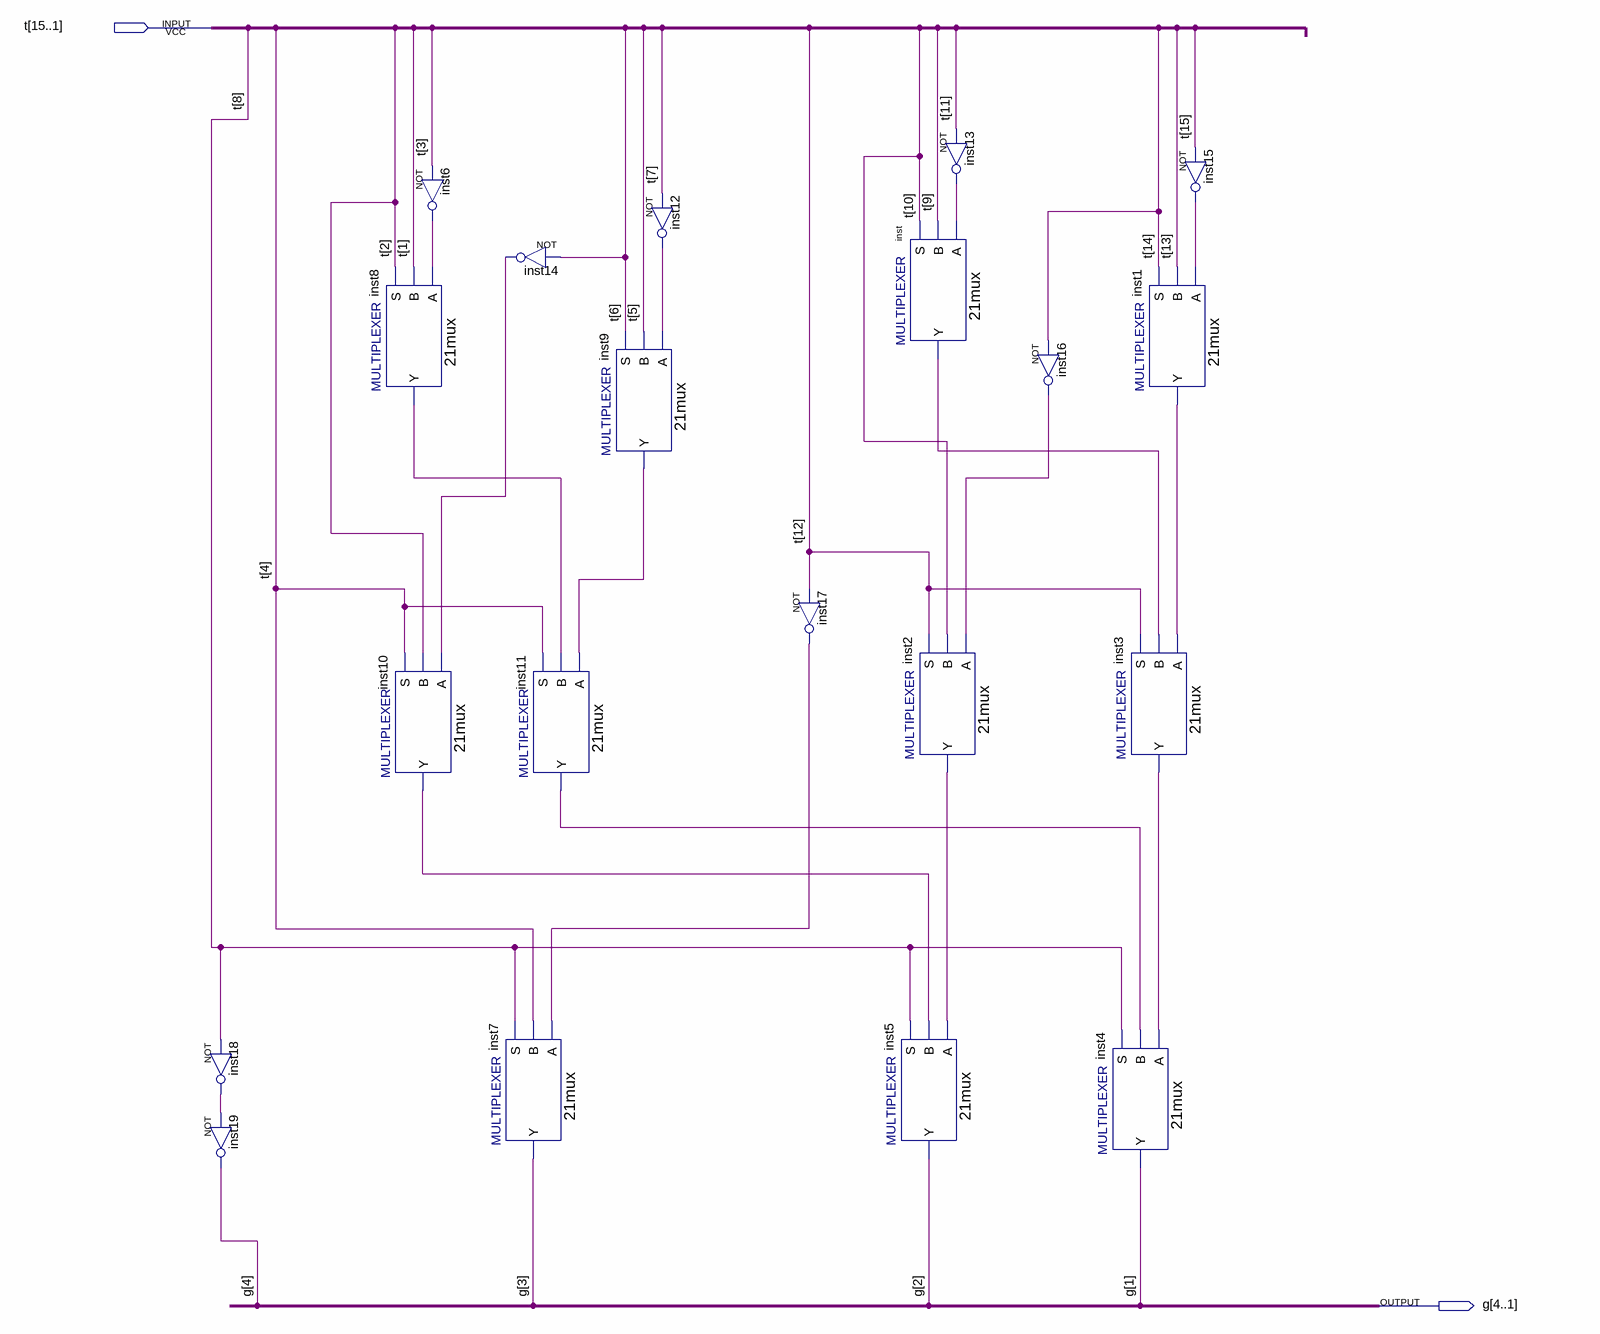
[diagram p0: schematic sheet]
// Quartus schematic decoder.bdf as structural Verilog: 20 symbols, 2 pins
module decoder (
  input  [15:1] t,
  output [4:1] g
);

  wire inst1_y, inst2_y, inst3_y, inst6_out, inst8_y, inst9_y, inst10_y, inst11_y, inst12_out, inst13_out,
       inst14_out, inst15_out, inst16_out, inst17_out, inst18_out, inst_y;

  not inst18 (inst18_out, t[8]);
  not inst19 (g[4], inst18_out);
  \21mux  inst8 (.S(t[2]), .B(t[1]), .A(inst6_out), .Y(inst8_y));
  \21mux  inst10 (.S(t[4]), .B(t[2]), .A(inst14_out), .Y(inst10_y));
  not inst6 (inst6_out, t[3]);
  not inst14 (inst14_out, t[6]);
  \21mux  inst11 (.S(t[4]), .B(inst8_y), .A(inst9_y), .Y(inst11_y));
  \21mux  inst7 (.S(t[8]), .B(t[4]), .A(inst17_out), .Y(g[3]));
  \21mux  inst9 (.S(t[6]), .B(t[5]), .A(inst12_out), .Y(inst9_y));
  not inst12 (inst12_out, t[7]);
  not inst17 (inst17_out, t[12]);
  \21mux  inst (.S(t[10]), .B(t[9]), .A(inst13_out), .Y(inst_y));
  \21mux  inst2 (.S(t[12]), .B(t[10]), .A(inst16_out), .Y(inst2_y));
  \21mux  inst5 (.S(t[8]), .B(inst10_y), .A(inst2_y), .Y(g[2]));
  not inst13 (inst13_out, t[11]);
  not inst16 (inst16_out, t[14]);
  \21mux  inst3 (.S(t[12]), .B(inst_y), .A(inst1_y), .Y(inst3_y));
  \21mux  inst4 (.S(t[8]), .B(inst11_y), .A(inst3_y), .Y(g[1]));
  not inst15 (inst15_out, t[15]);
  \21mux  inst1 (.S(t[14]), .B(t[13]), .A(inst15_out), .Y(inst1_y));
endmodule
